# Altium schematic sheet 23. SOC IO & SUPPORT POWER 2.SchDoc: SOC - DIGITAL & SUPPORT POWER 2 (part 2 of 3)
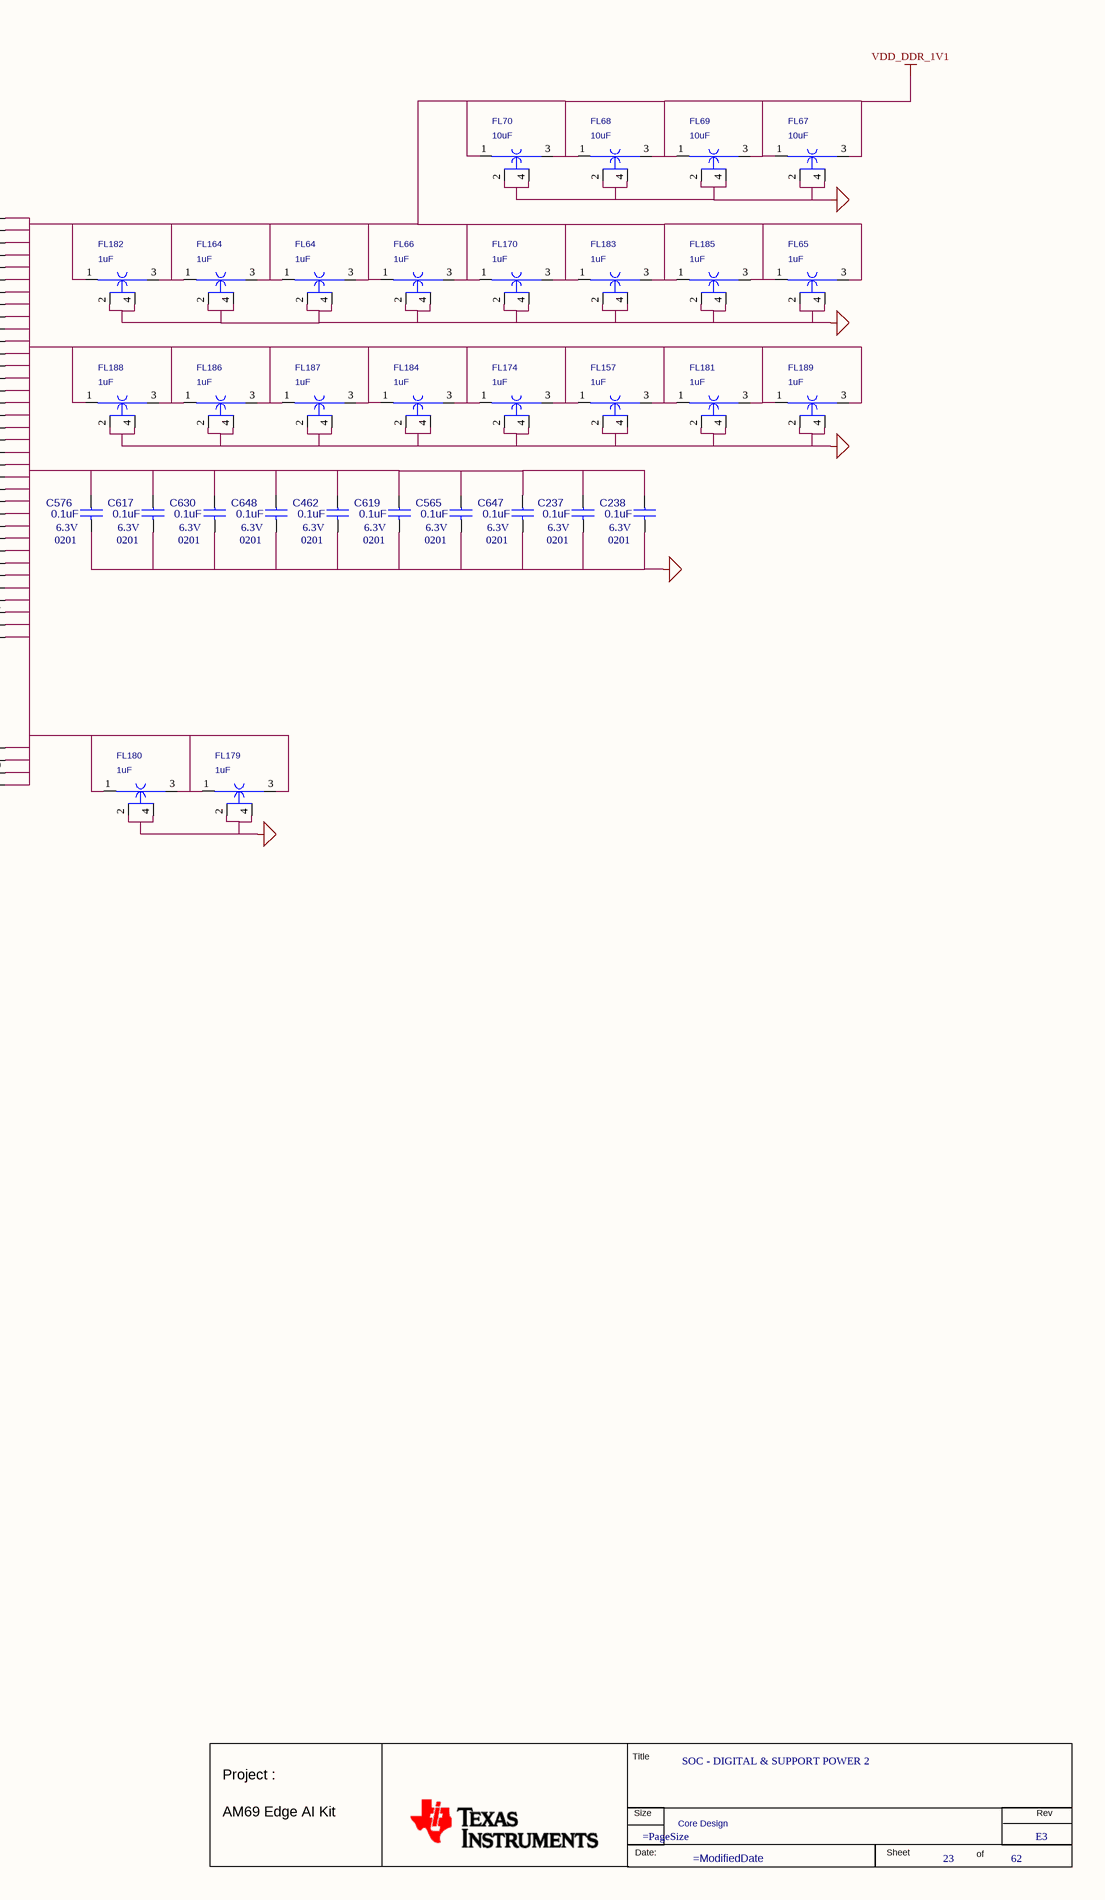
[diagram p2: 23. SOC IO & SUPPORT POWER 2.SchDoc, right]
## Library data of the parts
* = MISTRAL_TITLEBLK_CSIZE_1: Issue: 1.0; Project: PROC154E2(001)_SK_AM69; Name: PROC154E2 001 SK AM69; Page Create Date: March  8, 1995; Page Size: =PageSize; Page Modify Date: =ModifiedDate; Schematic Page Count: 62; Schematic Page Number: 23
C188 = CAP_Dup1: CAP CERAMIC 1uF 10V 10% X7S AUTO 0402; Part Reference: C188; Manufacturer: MURATA; Mistral Part No: 120018090021-R; Mfr_part_number: GCM155C71A105KE38D; Part_type: CAPACITORS\CERAMIC; Project: SMART-M_SCRIPTALK_PB; Wattage: NA; Customs_HS_Code: 85322990; Custom_Duty: 15%; Value: 1uF; Footprint Ref: CAP0402_0-75; Mfr_name: MURATA; Tolerance: 10%; Distributor_name: DIGIKEY; Distributor_part_number: 490-13409-1-ND; Library Ref: CAP; Height: 0.70MM; Weight: 6mg; Temperature: -55°C+125°C; Datasheet: Y:\MIS_DATABASE\DATASHEETS\CAPACITORS\MURATA-GCM-SER.PDF; Crtd /date: ALVY/100918; Chkd/date: MANIRAJA/100918; MECHANICAL 3D STEP FILE: CAP0402_0-75; Library Path: Y:\MIS_DATABASE\Library\ALTIUM_TOOL\SCHEMATICS_PARTS\MS_DISCRETE_Library.schlib; Footprint Path: Y:\MIS_DATABASE\Library\ALTIUM_TOOL\PCB_FOOTPRINTS\Altium_Footprint_Lib.PcbLib; PCB Footprint: CAP0402_0-75
C193 = CAP_Dup1: CAP CERAMIC 1uF 10V 10% X7S AUTO 0402; Part Reference: C193; Manufacturer: MURATA; Mistral Part No: 120018090021-R; Mfr_part_number: GCM155C71A105KE38D; Part_type: CAPACITORS\CERAMIC; Project: SMART-M_SCRIPTALK_PB; Wattage: NA; Customs_HS_Code: 85322990; Custom_Duty: 15%; Value: 1uF; Footprint Ref: CAP0402_0-75; Mfr_name: MURATA; Tolerance: 10%; Distributor_name: DIGIKEY; Distributor_part_number: 490-13409-1-ND; Library Ref: CAP; Height: 0.70MM; Weight: 6mg; Temperature: -55°C+125°C; Datasheet: Y:\MIS_DATABASE\DATASHEETS\CAPACITORS\MURATA-GCM-SER.PDF; Crtd /date: ALVY/100918; Chkd/date: MANIRAJA/100918; MECHANICAL 3D STEP FILE: CAP0402_0-75; Library Path: Y:\MIS_DATABASE\Library\ALTIUM_TOOL\SCHEMATICS_PARTS\MS_DISCRETE_Library.schlib; Footprint Path: Y:\MIS_DATABASE\Library\ALTIUM_TOOL\PCB_FOOTPRINTS\Altium_Footprint_Lib.PcbLib; PCB Footprint: CAP0402_0-75
C196 = CAP_Dup1: CAP CERAMIC 1uF 10V 10% X7S AUTO 0402; Part Reference: C196; Manufacturer: MURATA; Part_type: CAPACITORS\CERAMIC; Mfr_part_number: GCM155C71A105KE38D; Mistral Part No: 120018090021-R; Custom_Duty: 15%; Customs_HS_Code: 85322990; Wattage: NA; Project: SMART-M_SCRIPTALK_PB; Value: 1uF; Footprint Path: Y:\MIS_DATABASE\Library\ALTIUM_TOOL\PCB_FOOTPRINTS\Altium_Footprint_Lib.PcbLib; Library Path: Y:\MIS_DATABASE\Library\ALTIUM_TOOL\SCHEMATICS_PARTS\MS_DISCRETE_Library.schlib; MECHANICAL 3D STEP FILE: CAP0402_0-75; Chkd/date: MANIRAJA/100918; Crtd /date: ALVY/100918; Datasheet: Y:\MIS_DATABASE\DATASHEETS\CAPACITORS\MURATA-GCM-SER.PDF; Temperature: -55°C+125°C; Weight: 6mg; Height: 0.70MM; Library Ref: CAP; Distributor_part_number: 490-13409-1-ND; Distributor_name: DIGIKEY; Tolerance: 10%; Mfr_name: MURATA; Footprint Ref: CAP0402_0-75; PCB Footprint: CAP0402_0-75
C237 = CAP_Dup1: CAP CERAMIC 0.1uF 6.3V 10% X7S AUTO 0201; Part Reference: C237; Manufacturer: MURATA; Mistral Part No: 120018100001-R; Mfr_part_number: GCM033C70J104KE02D; Part_type: CAPACITORS\CERAMIC; Project: TI_J7_SVB-DUT; Wattage: NA; Customs_HS_Code: 85322990; Custom_Duty: 15%; Value: 0.1uF; Footprint Ref: CAP0201_0-5; Mfr_name: MURATA; Tolerance: 10%; Distributor_name: NA; Distributor_part_number: NA; Library Ref: CAP; Height: 0.33MM; Weight: NA; Temperature: -55°C+125°C; Datasheet: Y:\MIS_DATABASE\DATASHEETS\CAPACITORS\MURATA-GCM-SER.PDF; Crtd /date: MANIRAJA/011018; Chkd/date: MANIRAJA/011018; MECHANICAL 3D STEP FILE: CAP0201_0-5; Library Path: Y:\MIS_DATABASE\Library\ALTIUM_TOOL\SCHEMATICS_PARTS\MS_DISCRETE_Library.schlib; Footprint Path: Y:\MIS_DATABASE\Library\ALTIUM_TOOL\PCB_FOOTPRINTS\Altium_Footprint_Lib.PcbLib; PCB Footprint: CAP0201_0-5
C238 = CAP_Dup1: CAP CERAMIC 0.1uF 6.3V 10% X7S AUTO 0201; Part Reference: C238; Manufacturer: MURATA; Part_type: CAPACITORS\CERAMIC; Mfr_part_number: GCM033C70J104KE02D; Mistral Part No: 120018100001-R; Custom_Duty: 15%; Customs_HS_Code: 85322990; Wattage: NA; Project: TI_J7_SVB-DUT; Value: 0.1uF; Footprint Path: Y:\MIS_DATABASE\Library\ALTIUM_TOOL\PCB_FOOTPRINTS\Altium_Footprint_Lib.PcbLib; Library Path: Y:\MIS_DATABASE\Library\ALTIUM_TOOL\SCHEMATICS_PARTS\MS_DISCRETE_Library.schlib; MECHANICAL 3D STEP FILE: CAP0201_0-5; Chkd/date: MANIRAJA/011018; Crtd /date: MANIRAJA/011018; Datasheet: Y:\MIS_DATABASE\DATASHEETS\CAPACITORS\MURATA-GCM-SER.PDF; Temperature: -55°C+125°C; Weight: NA; Height: 0.33MM; Library Ref: CAP; Distributor_part_number: NA; Distributor_name: NA; Tolerance: 10%; Mfr_name: MURATA; Footprint Ref: CAP0201_0-5; PCB Footprint: CAP0201_0-5
C462 = CAP_Dup1: CAP CERAMIC 0.1uF 6.3V 10% X7S AUTO 0201; Part Reference: C462; Manufacturer: MURATA; Part_type: CAPACITORS\CERAMIC; Mfr_part_number: GCM033C70J104KE02D; Mistral Part No: 120018100001-R; Custom_Duty: 15%; Customs_HS_Code: 85322990; Wattage: NA; Project: TI_J7_SVB-DUT; Value: 0.1uF; Footprint Path: Y:\MIS_DATABASE\Library\ALTIUM_TOOL\PCB_FOOTPRINTS\Altium_Footprint_Lib.PcbLib; Library Path: Y:\MIS_DATABASE\Library\ALTIUM_TOOL\SCHEMATICS_PARTS\MS_DISCRETE_Library.schlib; MECHANICAL 3D STEP FILE: CAP0201_0-5; Chkd/date: MANIRAJA/011018; Crtd /date: MANIRAJA/011018; Datasheet: Y:\MIS_DATABASE\DATASHEETS\CAPACITORS\MURATA-GCM-SER.PDF; Temperature: -55°C+125°C; Weight: NA; Height: 0.33MM; Library Ref: CAP; Distributor_part_number: NA; Distributor_name: NA; Tolerance: 10%; Mfr_name: MURATA; Footprint Ref: CAP0201_0-5; PCB Footprint: CAP0201_0-5
C489 = CAP_Dup1: CAP CERAMIC 0.1uF 6.3V 10% X7S AUTO 0201; Part Reference: C489; Manufacturer: MURATA; Part_type: CAPACITORS\CERAMIC; Mfr_part_number: GCM033C70J104KE02D; Mistral Part No: 120018100001-R; Custom_Duty: 15%; Customs_HS_Code: 85322990; Wattage: NA; Project: TI_J7_SVB-DUT; Value: 0.1uF; Footprint Path: Y:\MIS_DATABASE\Library\ALTIUM_TOOL\PCB_FOOTPRINTS\Altium_Footprint_Lib.PcbLib; Library Path: Y:\MIS_DATABASE\Library\ALTIUM_TOOL\SCHEMATICS_PARTS\MS_DISCRETE_Library.schlib; MECHANICAL 3D STEP FILE: CAP0201_0-5; Chkd/date: MANIRAJA/011018; Crtd /date: MANIRAJA/011018; Datasheet: Y:\MIS_DATABASE\DATASHEETS\CAPACITORS\MURATA-GCM-SER.PDF; Temperature: -55°C+125°C; Weight: NA; Height: 0.33MM; Library Ref: CAP; Distributor_part_number: NA; Distributor_name: NA; Tolerance: 10%; Mfr_name: MURATA; Footprint Ref: CAP0201_0-5; PCB Footprint: CAP0201_0-5
C505 = CAP_Dup1: CAP CERAMIC 0.1uF 6.3V 10% X7S AUTO 0201; Part Reference: C505; Manufacturer: MURATA; Mistral Part No: 120018100001-R; Mfr_part_number: GCM033C70J104KE02D; Part_type: CAPACITORS\CERAMIC; Project: TI_J7_SVB-DUT; Wattage: NA; Customs_HS_Code: 85322990; Custom_Duty: 15%; Value: 0.1uF; Footprint Ref: CAP0201_0-5; Mfr_name: MURATA; Tolerance: 10%; Distributor_name: NA; Distributor_part_number: NA; Library Ref: CAP; Height: 0.33MM; Weight: NA; Temperature: -55°C+125°C; Datasheet: Y:\MIS_DATABASE\DATASHEETS\CAPACITORS\MURATA-GCM-SER.PDF; Crtd /date: MANIRAJA/011018; Chkd/date: MANIRAJA/011018; MECHANICAL 3D STEP FILE: CAP0201_0-5; Library Path: Y:\MIS_DATABASE\Library\ALTIUM_TOOL\SCHEMATICS_PARTS\MS_DISCRETE_Library.schlib; Footprint Path: Y:\MIS_DATABASE\Library\ALTIUM_TOOL\PCB_FOOTPRINTS\Altium_Footprint_Lib.PcbLib; PCB Footprint: CAP0201_0-5
C511 = CAP_Dup1: CAP CERAMIC 0.1uF 6.3V 10% X7S AUTO 0201; Part Reference: C511; Manufacturer: MURATA; Part_type: CAPACITORS\CERAMIC; Mfr_part_number: GCM033C70J104KE02D; Mistral Part No: 120018100001-R; Custom_Duty: 15%; Customs_HS_Code: 85322990; Wattage: NA; Project: TI_J7_SVB-DUT; Value: 0.1uF; Footprint Path: Y:\MIS_DATABASE\Library\ALTIUM_TOOL\PCB_FOOTPRINTS\Altium_Footprint_Lib.PcbLib; Library Path: Y:\MIS_DATABASE\Library\ALTIUM_TOOL\SCHEMATICS_PARTS\MS_DISCRETE_Library.schlib; MECHANICAL 3D STEP FILE: CAP0201_0-5; Chkd/date: MANIRAJA/011018; Crtd /date: MANIRAJA/011018; Datasheet: Y:\MIS_DATABASE\DATASHEETS\CAPACITORS\MURATA-GCM-SER.PDF; Temperature: -55°C+125°C; Weight: NA; Height: 0.33MM; Library Ref: CAP; Distributor_part_number: NA; Distributor_name: NA; Tolerance: 10%; Mfr_name: MURATA; Footprint Ref: CAP0201_0-5; PCB Footprint: CAP0201_0-5
C543 = CAP_Dup1: CAP CERAMIC 1uF 10V 10% X7S AUTO 0402; Part Reference: C543; Manufacturer: MURATA; Part_type: CAPACITORS\CERAMIC; Mfr_part_number: GCM155C71A105KE38D; Mistral Part No: 120018090021-R; Custom_Duty: 15%; Customs_HS_Code: 85322990; Wattage: NA; Project: SMART-M_SCRIPTALK_PB; Value: 1uF; Footprint Path: Y:\MIS_DATABASE\Library\ALTIUM_TOOL\PCB_FOOTPRINTS\Altium_Footprint_Lib.PcbLib; Library Path: Y:\MIS_DATABASE\Library\ALTIUM_TOOL\SCHEMATICS_PARTS\MS_DISCRETE_Library.schlib; MECHANICAL 3D STEP FILE: CAP0402_0-75; Chkd/date: MANIRAJA/100918; Crtd /date: ALVY/100918; Datasheet: Y:\MIS_DATABASE\DATASHEETS\CAPACITORS\MURATA-GCM-SER.PDF; Temperature: -55°C+125°C; Weight: 6mg; Height: 0.70MM; Library Ref: CAP; Distributor_part_number: 490-13409-1-ND; Distributor_name: DIGIKEY; Tolerance: 10%; Mfr_name: MURATA; Footprint Ref: CAP0402_0-75; PCB Footprint: CAP0402_0-75
C546 = CAP_Dup1: CAP CERAMIC 1uF 10V 10% X7S AUTO 0402; Part Reference: C546; Mistral Part No: 120018090021-R; Mfr_name: MURATA; Mfr_part_number: GCM155C71A105KE38D; Part_type: CAPACITORS\CERAMIC; Project: SMART-M_SCRIPTALK_PB; Wattage: NA; Customs_HS_Code: 85322990; Custom_Duty: 15%; Value: 1uF; Footprint Ref: CAP0402_0-75; Tolerance: 10%; Distributor_name: DIGIKEY; Distributor_part_number: 490-13409-1-ND; Library Ref: CAP; Height: 0.70MM; Weight: 6mg; Temperature: -55°C+125°C; Datasheet: Y:\MIS_DATABASE\DATASHEETS\CAPACITORS\MURATA-GCM-SER.PDF; Crtd /date: ALVY/100918; Chkd/date: MANIRAJA/100918; MECHANICAL 3D STEP FILE: CAP0402_0-75; Library Path: Y:\MIS_DATABASE\Library\ALTIUM_TOOL\SCHEMATICS_PARTS\MS_DISCRETE_Library.schlib; Footprint Path: Y:\MIS_DATABASE\Library\ALTIUM_TOOL\PCB_FOOTPRINTS\Altium_Footprint_Lib.PcbLib; Manufacturer: MURATA; PCB Footprint: CAP0402_0-75
C558 = CAP_Dup1: CAP CERAMIC 1uF 10V 10% X7S AUTO 0402; Part Reference: C558; Manufacturer: MURATA; Part_type: CAPACITORS\CERAMIC; Mfr_part_number: GCM155C71A105KE38D; Mistral Part No: 120018090021-R; Custom_Duty: 15%; Customs_HS_Code: 85322990; Wattage: NA; Project: SMART-M_SCRIPTALK_PB; Value: 1uF; Footprint Path: Y:\MIS_DATABASE\Library\ALTIUM_TOOL\PCB_FOOTPRINTS\Altium_Footprint_Lib.PcbLib; Library Path: Y:\MIS_DATABASE\Library\ALTIUM_TOOL\SCHEMATICS_PARTS\MS_DISCRETE_Library.schlib; MECHANICAL 3D STEP FILE: CAP0402_0-75; Chkd/date: MANIRAJA/100918; Crtd /date: ALVY/100918; Datasheet: Y:\MIS_DATABASE\DATASHEETS\CAPACITORS\MURATA-GCM-SER.PDF; Temperature: -55°C+125°C; Weight: 6mg; Height: 0.70MM; Library Ref: CAP; Distributor_part_number: 490-13409-1-ND; Distributor_name: DIGIKEY; Tolerance: 10%; Mfr_name: MURATA; Footprint Ref: CAP0402_0-75; PCB Footprint: CAP0402_0-75
C561 = CAP_Dup1: CAP CERAMIC 0.1uF 6.3V 10% X7S AUTO 0201; Part Reference: C561; Manufacturer: MURATA; Part_type: CAPACITORS\CERAMIC; Mfr_part_number: GCM033C70J104KE02D; Mistral Part No: 120018100001-R; Custom_Duty: 15%; Customs_HS_Code: 85322990; Wattage: NA; Project: TI_J7_SVB-DUT; Value: 0.1uF; Footprint Path: Y:\MIS_DATABASE\Library\ALTIUM_TOOL\PCB_FOOTPRINTS\Altium_Footprint_Lib.PcbLib; Library Path: Y:\MIS_DATABASE\Library\ALTIUM_TOOL\SCHEMATICS_PARTS\MS_DISCRETE_Library.schlib; MECHANICAL 3D STEP FILE: CAP0201_0-5; Chkd/date: MANIRAJA/011018; Crtd /date: MANIRAJA/011018; Datasheet: Y:\MIS_DATABASE\DATASHEETS\CAPACITORS\MURATA-GCM-SER.PDF; Temperature: -55°C+125°C; Weight: NA; Height: 0.33MM; Library Ref: CAP; Distributor_part_number: NA; Distributor_name: NA; Tolerance: 10%; Mfr_name: MURATA; Footprint Ref: CAP0201_0-5; PCB Footprint: CAP0201_0-5
C564 = CAP_Dup1: CAP CERAMIC 0.1uF 6.3V 10% X7S AUTO 0201; Part Reference: C564; Manufacturer: MURATA; Mistral Part No: 120018100001-R; Mfr_part_number: GCM033C70J104KE02D; Part_type: CAPACITORS\CERAMIC; Project: TI_J7_SVB-DUT; Wattage: NA; Customs_HS_Code: 85322990; Custom_Duty: 15%; Value: 0.1uF; Footprint Ref: CAP0201_0-5; Mfr_name: MURATA; Tolerance: 10%; Distributor_name: NA; Distributor_part_number: NA; Library Ref: CAP; Height: 0.33MM; Weight: NA; Temperature: -55°C+125°C; Datasheet: Y:\MIS_DATABASE\DATASHEETS\CAPACITORS\MURATA-GCM-SER.PDF; Crtd /date: MANIRAJA/011018; Chkd/date: MANIRAJA/011018; MECHANICAL 3D STEP FILE: CAP0201_0-5; Library Path: Y:\MIS_DATABASE\Library\ALTIUM_TOOL\SCHEMATICS_PARTS\MS_DISCRETE_Library.schlib; Footprint Path: Y:\MIS_DATABASE\Library\ALTIUM_TOOL\PCB_FOOTPRINTS\Altium_Footprint_Lib.PcbLib; PCB Footprint: CAP0201_0-5
C565 = CAP_Dup1: CAP CERAMIC 0.1uF 6.3V 10% X7S AUTO 0201; Part Reference: C565; Manufacturer: MURATA; Part_type: CAPACITORS\CERAMIC; Mfr_part_number: GCM033C70J104KE02D; Mistral Part No: 120018100001-R; Custom_Duty: 15%; Customs_HS_Code: 85322990; Wattage: NA; Project: TI_J7_SVB-DUT; Value: 0.1uF; Footprint Path: Y:\MIS_DATABASE\Library\ALTIUM_TOOL\PCB_FOOTPRINTS\Altium_Footprint_Lib.PcbLib; Library Path: Y:\MIS_DATABASE\Library\ALTIUM_TOOL\SCHEMATICS_PARTS\MS_DISCRETE_Library.schlib; MECHANICAL 3D STEP FILE: CAP0201_0-5; Chkd/date: MANIRAJA/011018; Crtd /date: MANIRAJA/011018; Datasheet: Y:\MIS_DATABASE\DATASHEETS\CAPACITORS\MURATA-GCM-SER.PDF; Temperature: -55°C+125°C; Weight: NA; Height: 0.33MM; Library Ref: CAP; Distributor_part_number: NA; Distributor_name: NA; Tolerance: 10%; Mfr_name: MURATA; Footprint Ref: CAP0201_0-5; PCB Footprint: CAP0201_0-5
C567 = CAP_Dup1: CAP CERAMIC 1uF 10V 10% X7S AUTO 0402; Part Reference: C567; Manufacturer: MURATA; Mistral Part No: 120018090021-R; Mfr_part_number: GCM155C71A105KE38D; Part_type: CAPACITORS\CERAMIC; Project: SMART-M_SCRIPTALK_PB; Wattage: NA; Customs_HS_Code: 85322990; Custom_Duty: 15%; Value: 1uF; Footprint Ref: CAP0402_0-75; Mfr_name: MURATA; Tolerance: 10%; Distributor_name: DIGIKEY; Distributor_part_number: 490-13409-1-ND; Library Ref: CAP; Height: 0.70MM; Weight: 6mg; Temperature: -55°C+125°C; Datasheet: Y:\MIS_DATABASE\DATASHEETS\CAPACITORS\MURATA-GCM-SER.PDF; Crtd /date: ALVY/100918; Chkd/date: MANIRAJA/100918; MECHANICAL 3D STEP FILE: CAP0402_0-75; Library Path: Y:\MIS_DATABASE\Library\ALTIUM_TOOL\SCHEMATICS_PARTS\MS_DISCRETE_Library.schlib; Footprint Path: Y:\MIS_DATABASE\Library\ALTIUM_TOOL\PCB_FOOTPRINTS\Altium_Footprint_Lib.PcbLib; PCB Footprint: CAP0402_0-75
C570 = CAP_Dup1: CAP CERAMIC 0.1uF 6.3V 10% X7S AUTO 0201; Part Reference: C570; Manufacturer: MURATA; Mistral Part No: 120018100001-R; Mfr_part_number: GCM033C70J104KE02D; Part_type: CAPACITORS\CERAMIC; Project: TI_J7_SVB-DUT; Wattage: NA; Customs_HS_Code: 85322990; Custom_Duty: 15%; Value: 0.1uF; Footprint Ref: CAP0201_0-5; Mfr_name: MURATA; Tolerance: 10%; Distributor_name: NA; Distributor_part_number: NA; Library Ref: CAP; Height: 0.33MM; Weight: NA; Temperature: -55°C+125°C; Datasheet: Y:\MIS_DATABASE\DATASHEETS\CAPACITORS\MURATA-GCM-SER.PDF; Crtd /date: MANIRAJA/011018; Chkd/date: MANIRAJA/011018; MECHANICAL 3D STEP FILE: CAP0201_0-5; Library Path: Y:\MIS_DATABASE\Library\ALTIUM_TOOL\SCHEMATICS_PARTS\MS_DISCRETE_Library.schlib; Footprint Path: Y:\MIS_DATABASE\Library\ALTIUM_TOOL\PCB_FOOTPRINTS\Altium_Footprint_Lib.PcbLib; PCB Footprint: CAP0201_0-5
C571 = CAP_Dup1: CAP CERAMIC 0.1uF 6.3V 10% X7S AUTO 0201; Part Reference: C571; Manufacturer: MURATA; Part_type: CAPACITORS\CERAMIC; Mfr_part_number: GCM033C70J104KE02D; Mistral Part No: 120018100001-R; Custom_Duty: 15%; Customs_HS_Code: 85322990; Wattage: NA; Project: TI_J7_SVB-DUT; Value: 0.1uF; Footprint Path: Y:\MIS_DATABASE\Library\ALTIUM_TOOL\PCB_FOOTPRINTS\Altium_Footprint_Lib.PcbLib; Library Path: Y:\MIS_DATABASE\Library\ALTIUM_TOOL\SCHEMATICS_PARTS\MS_DISCRETE_Library.schlib; MECHANICAL 3D STEP FILE: CAP0201_0-5; Chkd/date: MANIRAJA/011018; Crtd /date: MANIRAJA/011018; Datasheet: Y:\MIS_DATABASE\DATASHEETS\CAPACITORS\MURATA-GCM-SER.PDF; Temperature: -55°C+125°C; Weight: NA; Height: 0.33MM; Library Ref: CAP; Distributor_part_number: NA; Distributor_name: NA; Tolerance: 10%; Mfr_name: MURATA; Footprint Ref: CAP0201_0-5; PCB Footprint: CAP0201_0-5
C576 = CAP_Dup1: CAP CERAMIC 0.1uF 6.3V 10% X7S AUTO 0201; Part Reference: C576; Manufacturer: MURATA; Mistral Part No: 120018100001-R; Mfr_part_number: GCM033C70J104KE02D; Part_type: CAPACITORS\CERAMIC; Project: TI_J7_SVB-DUT; Wattage: NA; Customs_HS_Code: 85322990; Custom_Duty: 15%; Value: 0.1uF; Footprint Ref: CAP0201_0-5; Mfr_name: MURATA; Tolerance: 10%; Distributor_name: NA; Distributor_part_number: NA; Library Ref: CAP; Height: 0.33MM; Weight: NA; Temperature: -55°C+125°C; Datasheet: Y:\MIS_DATABASE\DATASHEETS\CAPACITORS\MURATA-GCM-SER.PDF; Crtd /date: MANIRAJA/011018; Chkd/date: MANIRAJA/011018; MECHANICAL 3D STEP FILE: CAP0201_0-5; Library Path: Y:\MIS_DATABASE\Library\ALTIUM_TOOL\SCHEMATICS_PARTS\MS_DISCRETE_Library.schlib; Footprint Path: Y:\MIS_DATABASE\Library\ALTIUM_TOOL\PCB_FOOTPRINTS\Altium_Footprint_Lib.PcbLib; PCB Footprint: CAP0201_0-5
C579 = CAP_Dup1: CAP CERAMIC 0.1uF 6.3V 10% X7S AUTO 0201; Part Reference: C579; Manufacturer: MURATA; Mistral Part No: 120018100001-R; Mfr_part_number: GCM033C70J104KE02D; Part_type: CAPACITORS\CERAMIC; Project: TI_J7_SVB-DUT; Wattage: NA; Customs_HS_Code: 85322990; Custom_Duty: 15%; Value: 0.1uF; Footprint Ref: CAP0201_0-5; Mfr_name: MURATA; Tolerance: 10%; Distributor_name: NA; Distributor_part_number: NA; Library Ref: CAP; Height: 0.33MM; Weight: NA; Temperature: -55°C+125°C; Datasheet: Y:\MIS_DATABASE\DATASHEETS\CAPACITORS\MURATA-GCM-SER.PDF; Crtd /date: MANIRAJA/011018; Chkd/date: MANIRAJA/011018; MECHANICAL 3D STEP FILE: CAP0201_0-5; Library Path: Y:\MIS_DATABASE\Library\ALTIUM_TOOL\SCHEMATICS_PARTS\MS_DISCRETE_Library.schlib; Footprint Path: Y:\MIS_DATABASE\Library\ALTIUM_TOOL\PCB_FOOTPRINTS\Altium_Footprint_Lib.PcbLib; PCB Footprint: CAP0201_0-5
C587 = CAP_Dup1: CAP CERAMIC 1uF 10V 10% X7S AUTO 0402; Part Reference: C587; Manufacturer: MURATA; Mistral Part No: 120018090021-R; Mfr_part_number: GCM155C71A105KE38D; Part_type: CAPACITORS\CERAMIC; Project: SMART-M_SCRIPTALK_PB; Wattage: NA; Customs_HS_Code: 85322990; Custom_Duty: 15%; Value: 1uF; Footprint Ref: CAP0402_0-75; Mfr_name: MURATA; Tolerance: 10%; Distributor_name: DIGIKEY; Distributor_part_number: 490-13409-1-ND; Library Ref: CAP; Height: 0.70MM; Weight: 6mg; Temperature: -55°C+125°C; Datasheet: Y:\MIS_DATABASE\DATASHEETS\CAPACITORS\MURATA-GCM-SER.PDF; Crtd /date: ALVY/100918; Chkd/date: MANIRAJA/100918; MECHANICAL 3D STEP FILE: CAP0402_0-75; Library Path: Y:\MIS_DATABASE\Library\ALTIUM_TOOL\SCHEMATICS_PARTS\MS_DISCRETE_Library.schlib; Footprint Path: Y:\MIS_DATABASE\Library\ALTIUM_TOOL\PCB_FOOTPRINTS\Altium_Footprint_Lib.PcbLib; PCB Footprint: CAP0402_0-75
C588 = CAP_Dup1: CAP CERAMIC 0.1uF 6.3V 10% X7S AUTO 0201; Part Reference: C588; Manufacturer: MURATA; Part_type: CAPACITORS\CERAMIC; Mfr_part_number: GCM033C70J104KE02D; Mistral Part No: 120018100001-R; Custom_Duty: 15%; Customs_HS_Code: 85322990; Wattage: NA; Project: TI_J7_SVB-DUT; Value: 0.1uF; Footprint Path: Y:\MIS_DATABASE\Library\ALTIUM_TOOL\PCB_FOOTPRINTS\Altium_Footprint_Lib.PcbLib; Library Path: Y:\MIS_DATABASE\Library\ALTIUM_TOOL\SCHEMATICS_PARTS\MS_DISCRETE_Library.schlib; MECHANICAL 3D STEP FILE: CAP0201_0-5; Chkd/date: MANIRAJA/011018; Crtd /date: MANIRAJA/011018; Datasheet: Y:\MIS_DATABASE\DATASHEETS\CAPACITORS\MURATA-GCM-SER.PDF; Temperature: -55°C+125°C; Weight: NA; Height: 0.33MM; Library Ref: CAP; Distributor_part_number: NA; Distributor_name: NA; Tolerance: 10%; Mfr_name: MURATA; Footprint Ref: CAP0201_0-5; PCB Footprint: CAP0201_0-5
C604 = CAP_Dup1: CAP CERAMIC 1uF 10V 10% X7S AUTO 0402; Part Reference: C604; Manufacturer: MURATA; Mistral Part No: 120018090021-R; Mfr_part_number: GCM155C71A105KE38D; Part_type: CAPACITORS\CERAMIC; Project: SMART-M_SCRIPTALK_PB; Wattage: NA; Customs_HS_Code: 85322990; Custom_Duty: 15%; Value: 1uF; Footprint Ref: CAP0402_0-75; Mfr_name: MURATA; Tolerance: 10%; Distributor_name: DIGIKEY; Distributor_part_number: 490-13409-1-ND; Library Ref: CAP; Height: 0.70MM; Weight: 6mg; Temperature: -55°C+125°C; Datasheet: Y:\MIS_DATABASE\DATASHEETS\CAPACITORS\MURATA-GCM-SER.PDF; Crtd /date: ALVY/100918; Chkd/date: MANIRAJA/100918; MECHANICAL 3D STEP FILE: CAP0402_0-75; Library Path: Y:\MIS_DATABASE\Library\ALTIUM_TOOL\SCHEMATICS_PARTS\MS_DISCRETE_Library.schlib; Footprint Path: Y:\MIS_DATABASE\Library\ALTIUM_TOOL\PCB_FOOTPRINTS\Altium_Footprint_Lib.PcbLib; PCB Footprint: CAP0402_0-75
C617 = CAP_Dup1: CAP CERAMIC 0.1uF 6.3V 10% X7S AUTO 0201; Part Reference: C617; Manufacturer: MURATA; Part_type: CAPACITORS\CERAMIC; Mfr_part_number: GCM033C70J104KE02D; Mistral Part No: 120018100001-R; Custom_Duty: 15%; Customs_HS_Code: 85322990; Wattage: NA; Project: TI_J7_SVB-DUT; Value: 0.1uF; Footprint Path: Y:\MIS_DATABASE\Library\ALTIUM_TOOL\PCB_FOOTPRINTS\Altium_Footprint_Lib.PcbLib; Library Path: Y:\MIS_DATABASE\Library\ALTIUM_TOOL\SCHEMATICS_PARTS\MS_DISCRETE_Library.schlib; MECHANICAL 3D STEP FILE: CAP0201_0-5; Chkd/date: MANIRAJA/011018; Crtd /date: MANIRAJA/011018; Datasheet: Y:\MIS_DATABASE\DATASHEETS\CAPACITORS\MURATA-GCM-SER.PDF; Temperature: -55°C+125°C; Weight: NA; Height: 0.33MM; Library Ref: CAP; Distributor_part_number: NA; Distributor_name: NA; Tolerance: 10%; Mfr_name: MURATA; Footprint Ref: CAP0201_0-5; PCB Footprint: CAP0201_0-5
C619 = CAP_Dup1: CAP CERAMIC 0.1uF 6.3V 10% X7S AUTO 0201; Part Reference: C619; Manufacturer: MURATA; Mistral Part No: 120018100001-R; Mfr_part_number: GCM033C70J104KE02D; Part_type: CAPACITORS\CERAMIC; Project: TI_J7_SVB-DUT; Wattage: NA; Customs_HS_Code: 85322990; Custom_Duty: 15%; Value: 0.1uF; Footprint Ref: CAP0201_0-5; Mfr_name: MURATA; Tolerance: 10%; Distributor_name: NA; Distributor_part_number: NA; Library Ref: CAP; Height: 0.33MM; Weight: NA; Temperature: -55°C+125°C; Datasheet: Y:\MIS_DATABASE\DATASHEETS\CAPACITORS\MURATA-GCM-SER.PDF; Crtd /date: MANIRAJA/011018; Chkd/date: MANIRAJA/011018; MECHANICAL 3D STEP FILE: CAP0201_0-5; Library Path: Y:\MIS_DATABASE\Library\ALTIUM_TOOL\SCHEMATICS_PARTS\MS_DISCRETE_Library.schlib; Footprint Path: Y:\MIS_DATABASE\Library\ALTIUM_TOOL\PCB_FOOTPRINTS\Altium_Footprint_Lib.PcbLib; PCB Footprint: CAP0201_0-5
C625 = CAP_Dup1: CAP CERAMIC 0.1uF 6.3V 10% X7S AUTO 0201; Part Reference: C625; Manufacturer: MURATA; Part_type: CAPACITORS\CERAMIC; Mfr_part_number: GCM033C70J104KE02D; Mistral Part No: 120018100001-R; Custom_Duty: 15%; Customs_HS_Code: 85322990; Wattage: NA; Project: TI_J7_SVB-DUT; Value: 0.1uF; Footprint Path: Y:\MIS_DATABASE\Library\ALTIUM_TOOL\PCB_FOOTPRINTS\Altium_Footprint_Lib.PcbLib; Library Path: Y:\MIS_DATABASE\Library\ALTIUM_TOOL\SCHEMATICS_PARTS\MS_DISCRETE_Library.schlib; MECHANICAL 3D STEP FILE: CAP0201_0-5; Chkd/date: MANIRAJA/011018; Crtd /date: MANIRAJA/011018; Datasheet: Y:\MIS_DATABASE\DATASHEETS\CAPACITORS\MURATA-GCM-SER.PDF; Temperature: -55°C+125°C; Weight: NA; Height: 0.33MM; Library Ref: CAP; Distributor_part_number: NA; Distributor_name: NA; Tolerance: 10%; Mfr_name: MURATA; Footprint Ref: CAP0201_0-5; PCB Footprint: CAP0201_0-5
C626 = CAP_Dup1: CAP CERAMIC 0.1uF 6.3V 10% X7S AUTO 0201; Part Reference: C626; Manufacturer: MURATA; Mistral Part No: 120018100001-R; Mfr_part_number: GCM033C70J104KE02D; Part_type: CAPACITORS\CERAMIC; Project: TI_J7_SVB-DUT; Wattage: NA; Customs_HS_Code: 85322990; Custom_Duty: 15%; Value: 0.1uF; Footprint Ref: CAP0201_0-5; Mfr_name: MURATA; Tolerance: 10%; Distributor_name: NA; Distributor_part_number: NA; Library Ref: CAP; Height: 0.33MM; Weight: NA; Temperature: -55°C+125°C; Datasheet: Y:\MIS_DATABASE\DATASHEETS\CAPACITORS\MURATA-GCM-SER.PDF; Crtd /date: MANIRAJA/011018; Chkd/date: MANIRAJA/011018; MECHANICAL 3D STEP FILE: CAP0201_0-5; Library Path: Y:\MIS_DATABASE\Library\ALTIUM_TOOL\SCHEMATICS_PARTS\MS_DISCRETE_Library.schlib; Footprint Path: Y:\MIS_DATABASE\Library\ALTIUM_TOOL\PCB_FOOTPRINTS\Altium_Footprint_Lib.PcbLib; PCB Footprint: CAP0201_0-5
C629 = CAP_Dup1: CAP CERAMIC 0.1uF 6.3V 10% X7S AUTO 0201; Part Reference: C629; Manufacturer: MURATA; Part_type: CAPACITORS\CERAMIC; Mfr_part_number: GCM033C70J104KE02D; Mistral Part No: 120018100001-R; Custom_Duty: 15%; Customs_HS_Code: 85322990; Wattage: NA; Project: TI_J7_SVB-DUT; Value: 0.1uF; Footprint Path: Y:\MIS_DATABASE\Library\ALTIUM_TOOL\PCB_FOOTPRINTS\Altium_Footprint_Lib.PcbLib; Library Path: Y:\MIS_DATABASE\Library\ALTIUM_TOOL\SCHEMATICS_PARTS\MS_DISCRETE_Library.schlib; MECHANICAL 3D STEP FILE: CAP0201_0-5; Chkd/date: MANIRAJA/011018; Crtd /date: MANIRAJA/011018; Datasheet: Y:\MIS_DATABASE\DATASHEETS\CAPACITORS\MURATA-GCM-SER.PDF; Temperature: -55°C+125°C; Weight: NA; Height: 0.33MM; Library Ref: CAP; Distributor_part_number: NA; Distributor_name: NA; Tolerance: 10%; Mfr_name: MURATA; Footprint Ref: CAP0201_0-5; PCB Footprint: CAP0201_0-5
C630 = CAP_Dup1: CAP CERAMIC 0.1uF 6.3V 10% X7S AUTO 0201; Part Reference: C630; Manufacturer: MURATA; Part_type: CAPACITORS\CERAMIC; Mfr_part_number: GCM033C70J104KE02D; Mistral Part No: 120018100001-R; Custom_Duty: 15%; Customs_HS_Code: 85322990; Wattage: NA; Project: TI_J7_SVB-DUT; Value: 0.1uF; Footprint Path: Y:\MIS_DATABASE\Library\ALTIUM_TOOL\PCB_FOOTPRINTS\Altium_Footprint_Lib.PcbLib; Library Path: Y:\MIS_DATABASE\Library\ALTIUM_TOOL\SCHEMATICS_PARTS\MS_DISCRETE_Library.schlib; MECHANICAL 3D STEP FILE: CAP0201_0-5; Chkd/date: MANIRAJA/011018; Crtd /date: MANIRAJA/011018; Datasheet: Y:\MIS_DATABASE\DATASHEETS\CAPACITORS\MURATA-GCM-SER.PDF; Temperature: -55°C+125°C; Weight: NA; Height: 0.33MM; Library Ref: CAP; Distributor_part_number: NA; Distributor_name: NA; Tolerance: 10%; Mfr_name: MURATA; Footprint Ref: CAP0201_0-5; PCB Footprint: CAP0201_0-5
C631 = CAP_Dup1: CAP CERAMIC 0.1uF 6.3V 10% X7S AUTO 0201; Part Reference: C631; Manufacturer: MURATA; Mistral Part No: 120018100001-R; Mfr_part_number: GCM033C70J104KE02D; Part_type: CAPACITORS\CERAMIC; Project: TI_J7_SVB-DUT; Wattage: NA; Customs_HS_Code: 85322990; Custom_Duty: 15%; Value: 0.1uF; Footprint Ref: CAP0201_0-5; Mfr_name: MURATA; Tolerance: 10%; Distributor_name: NA; Distributor_part_number: NA; Library Ref: CAP; Height: 0.33MM; Weight: NA; Temperature: -55°C+125°C; Datasheet: Y:\MIS_DATABASE\DATASHEETS\CAPACITORS\MURATA-GCM-SER.PDF; Crtd /date: MANIRAJA/011018; Chkd/date: MANIRAJA/011018; MECHANICAL 3D STEP FILE: CAP0201_0-5; Library Path: Y:\MIS_DATABASE\Library\ALTIUM_TOOL\SCHEMATICS_PARTS\MS_DISCRETE_Library.schlib; Footprint Path: Y:\MIS_DATABASE\Library\ALTIUM_TOOL\PCB_FOOTPRINTS\Altium_Footprint_Lib.PcbLib; PCB Footprint: CAP0201_0-5
C636 = CAP_Dup1: CAP CERAMIC 0.1uF 6.3V 10% X7S AUTO 0201; Part Reference: C636; Manufacturer: MURATA; Mistral Part No: 120018100001-R; Mfr_part_number: GCM033C70J104KE02D; Part_type: CAPACITORS\CERAMIC; Project: TI_J7_SVB-DUT; Wattage: NA; Customs_HS_Code: 85322990; Custom_Duty: 15%; Value: 0.1uF; Footprint Ref: CAP0201_0-5; Mfr_name: MURATA; Tolerance: 10%; Distributor_name: NA; Distributor_part_number: NA; Library Ref: CAP; Height: 0.33MM; Weight: NA; Temperature: -55°C+125°C; Datasheet: Y:\MIS_DATABASE\DATASHEETS\CAPACITORS\MURATA-GCM-SER.PDF; Crtd /date: MANIRAJA/011018; Chkd/date: MANIRAJA/011018; MECHANICAL 3D STEP FILE: CAP0201_0-5; Library Path: Y:\MIS_DATABASE\Library\ALTIUM_TOOL\SCHEMATICS_PARTS\MS_DISCRETE_Library.schlib; Footprint Path: Y:\MIS_DATABASE\Library\ALTIUM_TOOL\PCB_FOOTPRINTS\Altium_Footprint_Lib.PcbLib; PCB Footprint: CAP0201_0-5
C637 = CAP_Dup1: CAP CERAMIC 0.1uF 6.3V 10% X7S AUTO 0201; Part Reference: C637; Manufacturer: MURATA; Part_type: CAPACITORS\CERAMIC; Mfr_part_number: GCM033C70J104KE02D; Mistral Part No: 120018100001-R; Custom_Duty: 15%; Customs_HS_Code: 85322990; Wattage: NA; Project: TI_J7_SVB-DUT; Value: 0.1uF; Footprint Path: Y:\MIS_DATABASE\Library\ALTIUM_TOOL\PCB_FOOTPRINTS\Altium_Footprint_Lib.PcbLib; Library Path: Y:\MIS_DATABASE\Library\ALTIUM_TOOL\SCHEMATICS_PARTS\MS_DISCRETE_Library.schlib; MECHANICAL 3D STEP FILE: CAP0201_0-5; Chkd/date: MANIRAJA/011018; Crtd /date: MANIRAJA/011018; Datasheet: Y:\MIS_DATABASE\DATASHEETS\CAPACITORS\MURATA-GCM-SER.PDF; Temperature: -55°C+125°C; Weight: NA; Height: 0.33MM; Library Ref: CAP; Distributor_part_number: NA; Distributor_name: NA; Tolerance: 10%; Mfr_name: MURATA; Footprint Ref: CAP0201_0-5; PCB Footprint: CAP0201_0-5
C644 = CAP_Dup1: CAP CERAMIC 1uF 10V 10% X7S AUTO 0402; Part Reference: C644; Manufacturer: MURATA; Part_type: CAPACITORS\CERAMIC; Mfr_part_number: GCM155C71A105KE38D; Mistral Part No: 120018090021-R; Custom_Duty: 15%; Customs_HS_Code: 85322990; Wattage: NA; Project: SMART-M_SCRIPTALK_PB; Value: 1uF; Footprint Path: Y:\MIS_DATABASE\Library\ALTIUM_TOOL\PCB_FOOTPRINTS\Altium_Footprint_Lib.PcbLib; Library Path: Y:\MIS_DATABASE\Library\ALTIUM_TOOL\SCHEMATICS_PARTS\MS_DISCRETE_Library.schlib; MECHANICAL 3D STEP FILE: CAP0402_0-75; Chkd/date: MANIRAJA/100918; Crtd /date: ALVY/100918; Datasheet: Y:\MIS_DATABASE\DATASHEETS\CAPACITORS\MURATA-GCM-SER.PDF; Temperature: -55°C+125°C; Weight: 6mg; Height: 0.70MM; Library Ref: CAP; Distributor_part_number: 490-13409-1-ND; Distributor_name: DIGIKEY; Tolerance: 10%; Mfr_name: MURATA; Footprint Ref: CAP0402_0-75; PCB Footprint: CAP0402_0-75
C647 = CAP_Dup1: CAP CERAMIC 0.1uF 6.3V 10% X7S AUTO 0201; Part Reference: C647; Manufacturer: MURATA; Mistral Part No: 120018100001-R; Mfr_part_number: GCM033C70J104KE02D; Part_type: CAPACITORS\CERAMIC; Project: TI_J7_SVB-DUT; Wattage: NA; Customs_HS_Code: 85322990; Custom_Duty: 15%; Value: 0.1uF; Footprint Ref: CAP0201_0-5; Mfr_name: MURATA; Tolerance: 10%; Distributor_name: NA; Distributor_part_number: NA; Library Ref: CAP; Height: 0.33MM; Weight: NA; Temperature: -55°C+125°C; Datasheet: Y:\MIS_DATABASE\DATASHEETS\CAPACITORS\MURATA-GCM-SER.PDF; Crtd /date: MANIRAJA/011018; Chkd/date: MANIRAJA/011018; MECHANICAL 3D STEP FILE: CAP0201_0-5; Library Path: Y:\MIS_DATABASE\Library\ALTIUM_TOOL\SCHEMATICS_PARTS\MS_DISCRETE_Library.schlib; Footprint Path: Y:\MIS_DATABASE\Library\ALTIUM_TOOL\PCB_FOOTPRINTS\Altium_Footprint_Lib.PcbLib; PCB Footprint: CAP0201_0-5
C648 = CAP_Dup1: CAP CERAMIC 0.1uF 6.3V 10% X7S AUTO 0201; Part Reference: C648; Manufacturer: MURATA; Mistral Part No: 120018100001-R; Mfr_part_number: GCM033C70J104KE02D; Part_type: CAPACITORS\CERAMIC; Project: TI_J7_SVB-DUT; Wattage: NA; Customs_HS_Code: 85322990; Custom_Duty: 15%; Value: 0.1uF; Footprint Ref: CAP0201_0-5; Mfr_name: MURATA; Tolerance: 10%; Distributor_name: NA; Distributor_part_number: NA; Library Ref: CAP; Height: 0.33MM; Weight: NA; Temperature: -55°C+125°C; Datasheet: Y:\MIS_DATABASE\DATASHEETS\CAPACITORS\MURATA-GCM-SER.PDF; Crtd /date: MANIRAJA/011018; Chkd/date: MANIRAJA/011018; MECHANICAL 3D STEP FILE: CAP0201_0-5; Library Path: Y:\MIS_DATABASE\Library\ALTIUM_TOOL\SCHEMATICS_PARTS\MS_DISCRETE_Library.schlib; Footprint Path: Y:\MIS_DATABASE\Library\ALTIUM_TOOL\PCB_FOOTPRINTS\Altium_Footprint_Lib.PcbLib; PCB Footprint: CAP0201_0-5
C651 = CAP_Dup1: CAP CERAMIC 1uF 10V 10% X7S AUTO 0402; Part Reference: C651; Manufacturer: MURATA; Mistral Part No: 120018090021-R; Mfr_part_number: GCM155C71A105KE38D; Part_type: CAPACITORS\CERAMIC; Project: SMART-M_SCRIPTALK_PB; Wattage: NA; Customs_HS_Code: 85322990; Custom_Duty: 15%; Value: 1uF; Footprint Ref: CAP0402_0-75; Mfr_name: MURATA; Tolerance: 10%; Distributor_name: DIGIKEY; Distributor_part_number: 490-13409-1-ND; Library Ref: CAP; Height: 0.70MM; Weight: 6mg; Temperature: -55°C+125°C; Datasheet: Y:\MIS_DATABASE\DATASHEETS\CAPACITORS\MURATA-GCM-SER.PDF; Crtd /date: ALVY/100918; Chkd/date: MANIRAJA/100918; MECHANICAL 3D STEP FILE: CAP0402_0-75; Library Path: Y:\MIS_DATABASE\Library\ALTIUM_TOOL\SCHEMATICS_PARTS\MS_DISCRETE_Library.schlib; Footprint Path: Y:\MIS_DATABASE\Library\ALTIUM_TOOL\PCB_FOOTPRINTS\Altium_Footprint_Lib.PcbLib; PCB Footprint: CAP0402_0-75
C660 = CAP_Dup1: CAP CERAMIC 1uF 10V 10% X7S AUTO 0402; Part Reference: C660; Manufacturer: MURATA; Part_type: CAPACITORS\CERAMIC; Mfr_part_number: GCM155C71A105KE38D; Mistral Part No: 120018090021-R; Custom_Duty: 15%; Customs_HS_Code: 85322990; Wattage: NA; Project: SMART-M_SCRIPTALK_PB; Value: 1uF; Footprint Path: Y:\MIS_DATABASE\Library\ALTIUM_TOOL\PCB_FOOTPRINTS\Altium_Footprint_Lib.PcbLib; Library Path: Y:\MIS_DATABASE\Library\ALTIUM_TOOL\SCHEMATICS_PARTS\MS_DISCRETE_Library.schlib; MECHANICAL 3D STEP FILE: CAP0402_0-75; Chkd/date: MANIRAJA/100918; Crtd /date: ALVY/100918; Datasheet: Y:\MIS_DATABASE\DATASHEETS\CAPACITORS\MURATA-GCM-SER.PDF; Temperature: -55°C+125°C; Weight: 6mg; Height: 0.70MM; Library Ref: CAP; Distributor_part_number: 490-13409-1-ND; Distributor_name: DIGIKEY; Tolerance: 10%; Mfr_name: MURATA; Footprint Ref: CAP0402_0-75; PCB Footprint: CAP0402_0-75
C665 = CAP_Dup1: CAP CERAMIC 1uF 10V 10% X7S AUTO 0402; Part Reference: C665; Manufacturer: MURATA; Part_type: CAPACITORS\CERAMIC; Mfr_part_number: GCM155C71A105KE38D; Mistral Part No: 120018090021-R; Custom_Duty: 15%; Customs_HS_Code: 85322990; Wattage: NA; Project: SMART-M_SCRIPTALK_PB; Value: 1uF; Footprint Path: Y:\MIS_DATABASE\Library\ALTIUM_TOOL\PCB_FOOTPRINTS\Altium_Footprint_Lib.PcbLib; Library Path: Y:\MIS_DATABASE\Library\ALTIUM_TOOL\SCHEMATICS_PARTS\MS_DISCRETE_Library.schlib; MECHANICAL 3D STEP FILE: CAP0402_0-75; Chkd/date: MANIRAJA/100918; Crtd /date: ALVY/100918; Datasheet: Y:\MIS_DATABASE\DATASHEETS\CAPACITORS\MURATA-GCM-SER.PDF; Temperature: -55°C+125°C; Weight: 6mg; Height: 0.70MM; Library Ref: CAP; Distributor_part_number: 490-13409-1-ND; Distributor_name: DIGIKEY; Tolerance: 10%; Mfr_name: MURATA; Footprint Ref: CAP0402_0-75; PCB Footprint: CAP0402_0-75
FL64 = CAP_NFM_TI: PASSIVE FILTER EMI 1uF 4V AUTO 0402; Part Reference: FL64; Mfr_part_number: NFM15HC105D0G_TI; Mfr_name: MURATA; Mistral Part No: 130018100050; Custom_Duty: 15%; Customs_HS_Code: 85412900; Wattage: NA; Project: TI_J7ES_EVM_SOM; Value: 1uF; Footprint Path: Y:\MIS_DATABASE\Library\ALTIUM_TOOL\PCB_FOOTPRINTS\Altium_Footprint_Lib.PcbLib; Library Path: Y:\MIS_DATABASE\Library\ALTIUM_TOOL\SCHEMATICS_PARTS\MS_FILTER_Library.schlib; MECHANICAL 3D STEP FILE: EMIFIL_NFM15CC_0402_0-5_TI; RoHS: NA; Chkd/date: MANIRAJA/251018; Crtd /date: ALVY/251018; Datasheet: Y:\MIS_DATABASE\DATASHEETS\DISCRETES\INDUCTORS\NFM15CC223C1A3.PDF; Temperature: NA; Weight: NA; Height: 0.50MM; Library Ref: CAP_NFM_TI; Distributor_part_number: NA; Distributor_name: NA; Package: 0402; Voltage: 4V; Tolerance: NA; Part_type: FILTER; Footprint Ref: EMIFIL_NFM15CC_0402_0-5_TI; PCB Footprint: EMIFIL_NFM15CC_0402_0-5_TI
FL65 = CAP_NFM_TI: PASSIVE FILTER EMI 1uF 4V AUTO 0402; Part Reference: FL65; Mfr_part_number: NFM15HC105D0G_TI; Mfr_name: MURATA; Mistral Part No: 130018100050; Custom_Duty: 15%; Customs_HS_Code: 85412900; Wattage: NA; Project: TI_J7ES_EVM_SOM; Value: 1uF; Footprint Path: Y:\MIS_DATABASE\Library\ALTIUM_TOOL\PCB_FOOTPRINTS\Altium_Footprint_Lib.PcbLib; Library Path: Y:\MIS_DATABASE\Library\ALTIUM_TOOL\SCHEMATICS_PARTS\MS_FILTER_Library.schlib; MECHANICAL 3D STEP FILE: EMIFIL_NFM15CC_0402_0-5_TI; RoHS: NA; Chkd/date: MANIRAJA/251018; Crtd /date: ALVY/251018; Datasheet: Y:\MIS_DATABASE\DATASHEETS\DISCRETES\INDUCTORS\NFM15CC223C1A3.PDF; Temperature: NA; Weight: NA; Height: 0.50MM; Library Ref: CAP_NFM_TI; Distributor_part_number: NA; Distributor_name: NA; Package: 0402; Voltage: 4V; Tolerance: NA; Part_type: FILTER; Footprint Ref: EMIFIL_NFM15CC_0402_0-5_TI; PCB Footprint: EMIFIL_NFM15CC_0402_0-5_TI
FL66 = CAP_NFM_TI: PASSIVE FILTER EMI 1uF 4V AUTO 0402; Part Reference: FL66; Mfr_part_number: NFM15HC105D0G_TI; Mfr_name: MURATA; Mistral Part No: 130018100050; Custom_Duty: 15%; Customs_HS_Code: 85412900; Wattage: NA; Project: TI_J7ES_EVM_SOM; Value: 1uF; Footprint Path: Y:\MIS_DATABASE\Library\ALTIUM_TOOL\PCB_FOOTPRINTS\Altium_Footprint_Lib.PcbLib; Library Path: Y:\MIS_DATABASE\Library\ALTIUM_TOOL\SCHEMATICS_PARTS\MS_FILTER_Library.schlib; MECHANICAL 3D STEP FILE: EMIFIL_NFM15CC_0402_0-5_TI; RoHS: NA; Chkd/date: MANIRAJA/251018; Crtd /date: ALVY/251018; Datasheet: Y:\MIS_DATABASE\DATASHEETS\DISCRETES\INDUCTORS\NFM15CC223C1A3.PDF; Temperature: NA; Weight: NA; Height: 0.50MM; Library Ref: CAP_NFM_TI; Distributor_part_number: NA; Distributor_name: NA; Package: 0402; Voltage: 4V; Tolerance: NA; Part_type: FILTER; Footprint Ref: EMIFIL_NFM15CC_0402_0-5_TI; PCB Footprint: EMIFIL_NFM15CC_0402_0-5_TI
FL67 = CAP_NFM_TI: PASSIVE FILTER EMI 10uF 4V AUTO 0603; Part Reference: FL67; Mfr_part_number: NFM18HC106D0G_TI; Mfr_name: MURATA; Mistral Part No: 130018100049; Custom_Duty: 15%; Customs_HS_Code: 85412900; Wattage: NA; Project: TI_J7ES_EVM_SOM; Value: 10uF; Footprint Path: Y:\MIS_DATABASE\Library\ALTIUM_TOOL\PCB_FOOTPRINTS\Altium_Footprint_Lib.PcbLib; Library Path: Y:\MIS_DATABASE\Library\ALTIUM_TOOL\SCHEMATICS_PARTS\MS_FILTER_Library.schlib; MECHANICAL 3D STEP FILE: EMIFIL_NFM18C_0603_0-7_TI; RoHS: NA; Chkd/date: MANIRAJA/251018; Crtd /date: ALVY/251018; Datasheet: Y:\MIS_DATABASE\DATASHEETS\DISCRETES\INDUCTORS\NFM18HC-SER.PDF; Temperature: NA; Weight: NA; Height: 0.70MM; Library Ref: CAP_NFM_TI; Distributor_part_number: NA; Distributor_name: NA; Package: 0603; Voltage: 4V; Tolerance: NA; Part_type: FILTER; Footprint Ref: EMIFIL_NFM18C_0603_0-7_TI; PCB Footprint: EMIFIL_NFM18C_0603_0-7_TI
FL68 = CAP_NFM_TI: PASSIVE FILTER EMI 10uF 4V AUTO 0603; Part Reference: FL68; Mfr_part_number: NFM18HC106D0G_TI; Mfr_name: MURATA; Mistral Part No: 130018100049; Custom_Duty: 15%; Customs_HS_Code: 85412900; Wattage: NA; Project: TI_J7ES_EVM_SOM; Value: 10uF; Footprint Path: Y:\MIS_DATABASE\Library\ALTIUM_TOOL\PCB_FOOTPRINTS\Altium_Footprint_Lib.PcbLib; Library Path: Y:\MIS_DATABASE\Library\ALTIUM_TOOL\SCHEMATICS_PARTS\MS_FILTER_Library.schlib; MECHANICAL 3D STEP FILE: EMIFIL_NFM18C_0603_0-7_TI; RoHS: NA; Chkd/date: MANIRAJA/251018; Crtd /date: ALVY/251018; Datasheet: Y:\MIS_DATABASE\DATASHEETS\DISCRETES\INDUCTORS\NFM18HC-SER.PDF; Temperature: NA; Weight: NA; Height: 0.70MM; Library Ref: CAP_NFM_TI; Distributor_part_number: NA; Distributor_name: NA; Package: 0603; Voltage: 4V; Tolerance: NA; Part_type: FILTER; Footprint Ref: EMIFIL_NFM18C_0603_0-7_TI; PCB Footprint: EMIFIL_NFM18C_0603_0-7_TI
FL69 = CAP_NFM_TI: PASSIVE FILTER EMI 10uF 4V AUTO 0603; Part Reference: FL69; Mfr_part_number: NFM18HC106D0G_TI; Mfr_name: MURATA; Mistral Part No: 130018100049; Custom_Duty: 15%; Customs_HS_Code: 85412900; Wattage: NA; Project: TI_J7ES_EVM_SOM; Value: 10uF; Footprint Path: Y:\MIS_DATABASE\Library\ALTIUM_TOOL\PCB_FOOTPRINTS\Altium_Footprint_Lib.PcbLib; Library Path: Y:\MIS_DATABASE\Library\ALTIUM_TOOL\SCHEMATICS_PARTS\MS_FILTER_Library.schlib; MECHANICAL 3D STEP FILE: EMIFIL_NFM18C_0603_0-7_TI; RoHS: NA; Chkd/date: MANIRAJA/251018; Crtd /date: ALVY/251018; Datasheet: Y:\MIS_DATABASE\DATASHEETS\DISCRETES\INDUCTORS\NFM18HC-SER.PDF; Temperature: NA; Weight: NA; Height: 0.70MM; Library Ref: CAP_NFM_TI; Distributor_part_number: NA; Distributor_name: NA; Package: 0603; Voltage: 4V; Tolerance: NA; Part_type: FILTER; Footprint Ref: EMIFIL_NFM18C_0603_0-7_TI; PCB Footprint: EMIFIL_NFM18C_0603_0-7_TI
FL70 = CAP_NFM_TI: PASSIVE FILTER EMI 10uF 4V AUTO 0603; Part Reference: FL70; Mfr_part_number: NFM18HC106D0G_TI; Mfr_name: MURATA; Mistral Part No: 130018100049; Custom_Duty: 15%; Customs_HS_Code: 85412900; Wattage: NA; Project: TI_J7ES_EVM_SOM; Value: 10uF; Footprint Path: Y:\MIS_DATABASE\Library\ALTIUM_TOOL\PCB_FOOTPRINTS\Altium_Footprint_Lib.PcbLib; Library Path: Y:\MIS_DATABASE\Library\ALTIUM_TOOL\SCHEMATICS_PARTS\MS_FILTER_Library.schlib; MECHANICAL 3D STEP FILE: EMIFIL_NFM18C_0603_0-7_TI; RoHS: NA; Chkd/date: MANIRAJA/251018; Crtd /date: ALVY/251018; Datasheet: Y:\MIS_DATABASE\DATASHEETS\DISCRETES\INDUCTORS\NFM18HC-SER.PDF; Temperature: NA; Weight: NA; Height: 0.70MM; Library Ref: CAP_NFM_TI; Distributor_part_number: NA; Distributor_name: NA; Package: 0603; Voltage: 4V; Tolerance: NA; Part_type: FILTER; Footprint Ref: EMIFIL_NFM18C_0603_0-7_TI; PCB Footprint: EMIFIL_NFM18C_0603_0-7_TI
FL157 = CAP_NFM_TI: PASSIVE FILTER EMI 1uF 4V AUTO 0402; Part Reference: FL157; Mfr_part_number: NFM15HC105D0G_TI; Mfr_name: MURATA; Mistral Part No: 130018100050; Custom_Duty: 15%; Customs_HS_Code: 85412900; Wattage: NA; Project: TI_J7ES_EVM_SOM; Value: 1uF; Footprint Path: Y:\MIS_DATABASE\Library\ALTIUM_TOOL\PCB_FOOTPRINTS\Altium_Footprint_Lib.PcbLib; Library Path: Y:\MIS_DATABASE\Library\ALTIUM_TOOL\SCHEMATICS_PARTS\MS_FILTER_Library.schlib; MECHANICAL 3D STEP FILE: EMIFIL_NFM15CC_0402_0-5_TI; RoHS: NA; Chkd/date: MANIRAJA/251018; Crtd /date: ALVY/251018; Datasheet: Y:\MIS_DATABASE\DATASHEETS\DISCRETES\INDUCTORS\NFM15CC223C1A3.PDF; Temperature: NA; Weight: NA; Height: 0.50MM; Library Ref: CAP_NFM_TI; Distributor_part_number: NA; Distributor_name: NA; Package: 0402; Voltage: 4V; Tolerance: NA; Part_type: FILTER; Footprint Ref: EMIFIL_NFM15CC_0402_0-5_TI; PCB Footprint: EMIFIL_NFM15CC_0402_0-5_TI
FL164 = CAP_NFM_TI: PASSIVE FILTER EMI 1uF 4V AUTO 0402; Part Reference: FL164; Mfr_part_number: NFM15HC105D0G_TI; Mfr_name: MURATA; Mistral Part No: 130018100050; Custom_Duty: 15%; Customs_HS_Code: 85412900; Wattage: NA; Project: TI_J7ES_EVM_SOM; Value: 1uF; Footprint Path: Y:\MIS_DATABASE\Library\ALTIUM_TOOL\PCB_FOOTPRINTS\Altium_Footprint_Lib.PcbLib; Library Path: Y:\MIS_DATABASE\Library\ALTIUM_TOOL\SCHEMATICS_PARTS\MS_FILTER_Library.schlib; MECHANICAL 3D STEP FILE: EMIFIL_NFM15CC_0402_0-5_TI; RoHS: NA; Chkd/date: MANIRAJA/251018; Crtd /date: ALVY/251018; Datasheet: Y:\MIS_DATABASE\DATASHEETS\DISCRETES\INDUCTORS\NFM15CC223C1A3.PDF; Temperature: NA; Weight: NA; Height: 0.50MM; Library Ref: CAP_NFM_TI; Distributor_part_number: NA; Distributor_name: NA; Package: 0402; Voltage: 4V; Tolerance: NA; Part_type: FILTER; Footprint Ref: EMIFIL_NFM15CC_0402_0-5_TI; PCB Footprint: EMIFIL_NFM15CC_0402_0-5_TI
FL170 = CAP_NFM_TI: PASSIVE FILTER EMI 1uF 4V AUTO 0402; Part Reference: FL170; Mfr_part_number: NFM15HC105D0G_TI; Mfr_name: MURATA; Mistral Part No: 130018100050; Custom_Duty: 15%; Customs_HS_Code: 85412900; Wattage: NA; Project: TI_J7ES_EVM_SOM; Value: 1uF; Footprint Path: Y:\MIS_DATABASE\Library\ALTIUM_TOOL\PCB_FOOTPRINTS\Altium_Footprint_Lib.PcbLib; Library Path: Y:\MIS_DATABASE\Library\ALTIUM_TOOL\SCHEMATICS_PARTS\MS_FILTER_Library.schlib; MECHANICAL 3D STEP FILE: EMIFIL_NFM15CC_0402_0-5_TI; RoHS: NA; Chkd/date: MANIRAJA/251018; Crtd /date: ALVY/251018; Datasheet: Y:\MIS_DATABASE\DATASHEETS\DISCRETES\INDUCTORS\NFM15CC223C1A3.PDF; Temperature: NA; Weight: NA; Height: 0.50MM; Library Ref: CAP_NFM_TI; Distributor_part_number: NA; Distributor_name: NA; Package: 0402; Voltage: 4V; Tolerance: NA; Part_type: FILTER; Footprint Ref: EMIFIL_NFM15CC_0402_0-5_TI; PCB Footprint: EMIFIL_NFM15CC_0402_0-5_TI
FL174 = CAP_NFM_TI: PASSIVE FILTER EMI 1uF 4V AUTO 0402; Part Reference: FL174; Mfr_part_number: NFM15HC105D0G_TI; Mfr_name: MURATA; Mistral Part No: 130018100050; Custom_Duty: 15%; Customs_HS_Code: 85412900; Wattage: NA; Project: TI_J7ES_EVM_SOM; Value: 1uF; Footprint Path: Y:\MIS_DATABASE\Library\ALTIUM_TOOL\PCB_FOOTPRINTS\Altium_Footprint_Lib.PcbLib; Library Path: Y:\MIS_DATABASE\Library\ALTIUM_TOOL\SCHEMATICS_PARTS\MS_FILTER_Library.schlib; MECHANICAL 3D STEP FILE: EMIFIL_NFM15CC_0402_0-5_TI; RoHS: NA; Chkd/date: MANIRAJA/251018; Crtd /date: ALVY/251018; Datasheet: Y:\MIS_DATABASE\DATASHEETS\DISCRETES\INDUCTORS\NFM15CC223C1A3.PDF; Temperature: NA; Weight: NA; Height: 0.50MM; Library Ref: CAP_NFM_TI; Distributor_part_number: NA; Distributor_name: NA; Package: 0402; Voltage: 4V; Tolerance: NA; Part_type: FILTER; Footprint Ref: EMIFIL_NFM15CC_0402_0-5_TI; PCB Footprint: EMIFIL_NFM15CC_0402_0-5_TI
FL179 = CAP_NFM_TI: PASSIVE FILTER EMI 1uF 4V AUTO 0402; Part Reference: FL179; Mfr_part_number: NFM15HC105D0G_TI; Mfr_name: MURATA; Mistral Part No: 130018100050; Custom_Duty: 15%; Customs_HS_Code: 85412900; Wattage: NA; Project: TI_J7ES_EVM_SOM; Value: 1uF; Footprint Path: Y:\MIS_DATABASE\Library\ALTIUM_TOOL\PCB_FOOTPRINTS\Altium_Footprint_Lib.PcbLib; Library Path: Y:\MIS_DATABASE\Library\ALTIUM_TOOL\SCHEMATICS_PARTS\MS_FILTER_Library.schlib; MECHANICAL 3D STEP FILE: EMIFIL_NFM15CC_0402_0-5_TI; RoHS: NA; Chkd/date: MANIRAJA/251018; Crtd /date: ALVY/251018; Datasheet: Y:\MIS_DATABASE\DATASHEETS\DISCRETES\INDUCTORS\NFM15CC223C1A3.PDF; Temperature: NA; Weight: NA; Height: 0.50MM; Library Ref: CAP_NFM_TI; Distributor_part_number: NA; Distributor_name: NA; Package: 0402; Voltage: 4V; Tolerance: NA; Part_type: FILTER; Footprint Ref: EMIFIL_NFM15CC_0402_0-5_TI; PCB Footprint: EMIFIL_NFM15CC_0402_0-5_TI
FL180 = CAP_NFM_TI: PASSIVE FILTER EMI 1uF 4V AUTO 0402; Part Reference: FL180; Mfr_part_number: NFM15HC105D0G_TI; Mfr_name: MURATA; Mistral Part No: 130018100050; Custom_Duty: 15%; Customs_HS_Code: 85412900; Wattage: NA; Project: TI_J7ES_EVM_SOM; Value: 1uF; Footprint Path: Y:\MIS_DATABASE\Library\ALTIUM_TOOL\PCB_FOOTPRINTS\Altium_Footprint_Lib.PcbLib; Library Path: Y:\MIS_DATABASE\Library\ALTIUM_TOOL\SCHEMATICS_PARTS\MS_FILTER_Library.schlib; MECHANICAL 3D STEP FILE: EMIFIL_NFM15CC_0402_0-5_TI; RoHS: NA; Chkd/date: MANIRAJA/251018; Crtd /date: ALVY/251018; Datasheet: Y:\MIS_DATABASE\DATASHEETS\DISCRETES\INDUCTORS\NFM15CC223C1A3.PDF; Temperature: NA; Weight: NA; Height: 0.50MM; Library Ref: CAP_NFM_TI; Distributor_part_number: NA; Distributor_name: NA; Package: 0402; Voltage: 4V; Tolerance: NA; Part_type: FILTER; Footprint Ref: EMIFIL_NFM15CC_0402_0-5_TI; PCB Footprint: EMIFIL_NFM15CC_0402_0-5_TI
FL181 = CAP_NFM_TI: PASSIVE FILTER EMI 1uF 4V AUTO 0402; Part Reference: FL181; Mfr_part_number: NFM15HC105D0G_TI; Mfr_name: MURATA; Mistral Part No: 130018100050; Custom_Duty: 15%; Customs_HS_Code: 85412900; Wattage: NA; Project: TI_J7ES_EVM_SOM; Value: 1uF; Footprint Path: Y:\MIS_DATABASE\Library\ALTIUM_TOOL\PCB_FOOTPRINTS\Altium_Footprint_Lib.PcbLib; Library Path: Y:\MIS_DATABASE\Library\ALTIUM_TOOL\SCHEMATICS_PARTS\MS_FILTER_Library.schlib; MECHANICAL 3D STEP FILE: EMIFIL_NFM15CC_0402_0-5_TI; RoHS: NA; Chkd/date: MANIRAJA/251018; Crtd /date: ALVY/251018; Datasheet: Y:\MIS_DATABASE\DATASHEETS\DISCRETES\INDUCTORS\NFM15CC223C1A3.PDF; Temperature: NA; Weight: NA; Height: 0.50MM; Library Ref: CAP_NFM_TI; Distributor_part_number: NA; Distributor_name: NA; Package: 0402; Voltage: 4V; Tolerance: NA; Part_type: FILTER; Footprint Ref: EMIFIL_NFM15CC_0402_0-5_TI; PCB Footprint: EMIFIL_NFM15CC_0402_0-5_TI
FL182 = CAP_NFM_TI: PASSIVE FILTER EMI 1uF 4V AUTO 0402; Part Reference: FL182; Mfr_part_number: NFM15HC105D0G_TI; Mfr_name: MURATA; Mistral Part No: 130018100050; Custom_Duty: 15%; Customs_HS_Code: 85412900; Wattage: NA; Project: TI_J7ES_EVM_SOM; Value: 1uF; Footprint Path: Y:\MIS_DATABASE\Library\ALTIUM_TOOL\PCB_FOOTPRINTS\Altium_Footprint_Lib.PcbLib; Library Path: Y:\MIS_DATABASE\Library\ALTIUM_TOOL\SCHEMATICS_PARTS\MS_FILTER_Library.schlib; MECHANICAL 3D STEP FILE: EMIFIL_NFM15CC_0402_0-5_TI; RoHS: NA; Chkd/date: MANIRAJA/251018; Crtd /date: ALVY/251018; Datasheet: Y:\MIS_DATABASE\DATASHEETS\DISCRETES\INDUCTORS\NFM15CC223C1A3.PDF; Temperature: NA; Weight: NA; Height: 0.50MM; Library Ref: CAP_NFM_TI; Distributor_part_number: NA; Distributor_name: NA; Package: 0402; Voltage: 4V; Tolerance: NA; Part_type: FILTER; Footprint Ref: EMIFIL_NFM15CC_0402_0-5_TI; PCB Footprint: EMIFIL_NFM15CC_0402_0-5_TI
FL183 = CAP_NFM_TI: PASSIVE FILTER EMI 1uF 4V AUTO 0402; Part Reference: FL183; Mfr_part_number: NFM15HC105D0G_TI; Mfr_name: MURATA; Mistral Part No: 130018100050; Custom_Duty: 15%; Customs_HS_Code: 85412900; Wattage: NA; Project: TI_J7ES_EVM_SOM; Value: 1uF; Footprint Path: Y:\MIS_DATABASE\Library\ALTIUM_TOOL\PCB_FOOTPRINTS\Altium_Footprint_Lib.PcbLib; Library Path: Y:\MIS_DATABASE\Library\ALTIUM_TOOL\SCHEMATICS_PARTS\MS_FILTER_Library.schlib; MECHANICAL 3D STEP FILE: EMIFIL_NFM15CC_0402_0-5_TI; RoHS: NA; Chkd/date: MANIRAJA/251018; Crtd /date: ALVY/251018; Datasheet: Y:\MIS_DATABASE\DATASHEETS\DISCRETES\INDUCTORS\NFM15CC223C1A3.PDF; Temperature: NA; Weight: NA; Height: 0.50MM; Library Ref: CAP_NFM_TI; Distributor_part_number: NA; Distributor_name: NA; Package: 0402; Voltage: 4V; Tolerance: NA; Part_type: FILTER; Footprint Ref: EMIFIL_NFM15CC_0402_0-5_TI; PCB Footprint: EMIFIL_NFM15CC_0402_0-5_TI
FL184 = CAP_NFM_TI: PASSIVE FILTER EMI 1uF 4V AUTO 0402; Part Reference: FL184; Mfr_part_number: NFM15HC105D0G_TI; Mfr_name: MURATA; Mistral Part No: 130018100050; Custom_Duty: 15%; Customs_HS_Code: 85412900; Wattage: NA; Project: TI_J7ES_EVM_SOM; Value: 1uF; Footprint Path: Y:\MIS_DATABASE\Library\ALTIUM_TOOL\PCB_FOOTPRINTS\Altium_Footprint_Lib.PcbLib; Library Path: Y:\MIS_DATABASE\Library\ALTIUM_TOOL\SCHEMATICS_PARTS\MS_FILTER_Library.schlib; MECHANICAL 3D STEP FILE: EMIFIL_NFM15CC_0402_0-5_TI; RoHS: NA; Chkd/date: MANIRAJA/251018; Crtd /date: ALVY/251018; Datasheet: Y:\MIS_DATABASE\DATASHEETS\DISCRETES\INDUCTORS\NFM15CC223C1A3.PDF; Temperature: NA; Weight: NA; Height: 0.50MM; Library Ref: CAP_NFM_TI; Distributor_part_number: NA; Distributor_name: NA; Package: 0402; Voltage: 4V; Tolerance: NA; Part_type: FILTER; Footprint Ref: EMIFIL_NFM15CC_0402_0-5_TI; PCB Footprint: EMIFIL_NFM15CC_0402_0-5_TI
FL185 = CAP_NFM_TI: PASSIVE FILTER EMI 1uF 4V AUTO 0402; Part Reference: FL185; Mfr_part_number: NFM15HC105D0G_TI; Mfr_name: MURATA; Mistral Part No: 130018100050; Custom_Duty: 15%; Customs_HS_Code: 85412900; Wattage: NA; Project: TI_J7ES_EVM_SOM; Value: 1uF; Footprint Path: Y:\MIS_DATABASE\Library\ALTIUM_TOOL\PCB_FOOTPRINTS\Altium_Footprint_Lib.PcbLib; Library Path: Y:\MIS_DATABASE\Library\ALTIUM_TOOL\SCHEMATICS_PARTS\MS_FILTER_Library.schlib; MECHANICAL 3D STEP FILE: EMIFIL_NFM15CC_0402_0-5_TI; RoHS: NA; Chkd/date: MANIRAJA/251018; Crtd /date: ALVY/251018; Datasheet: Y:\MIS_DATABASE\DATASHEETS\DISCRETES\INDUCTORS\NFM15CC223C1A3.PDF; Temperature: NA; Weight: NA; Height: 0.50MM; Library Ref: CAP_NFM_TI; Distributor_part_number: NA; Distributor_name: NA; Package: 0402; Voltage: 4V; Tolerance: NA; Part_type: FILTER; Footprint Ref: EMIFIL_NFM15CC_0402_0-5_TI; PCB Footprint: EMIFIL_NFM15CC_0402_0-5_TI